# Altium schematic sheet Power delivery.SchDoc
size A3; SheetNumber: 4; SheetTotal: 7
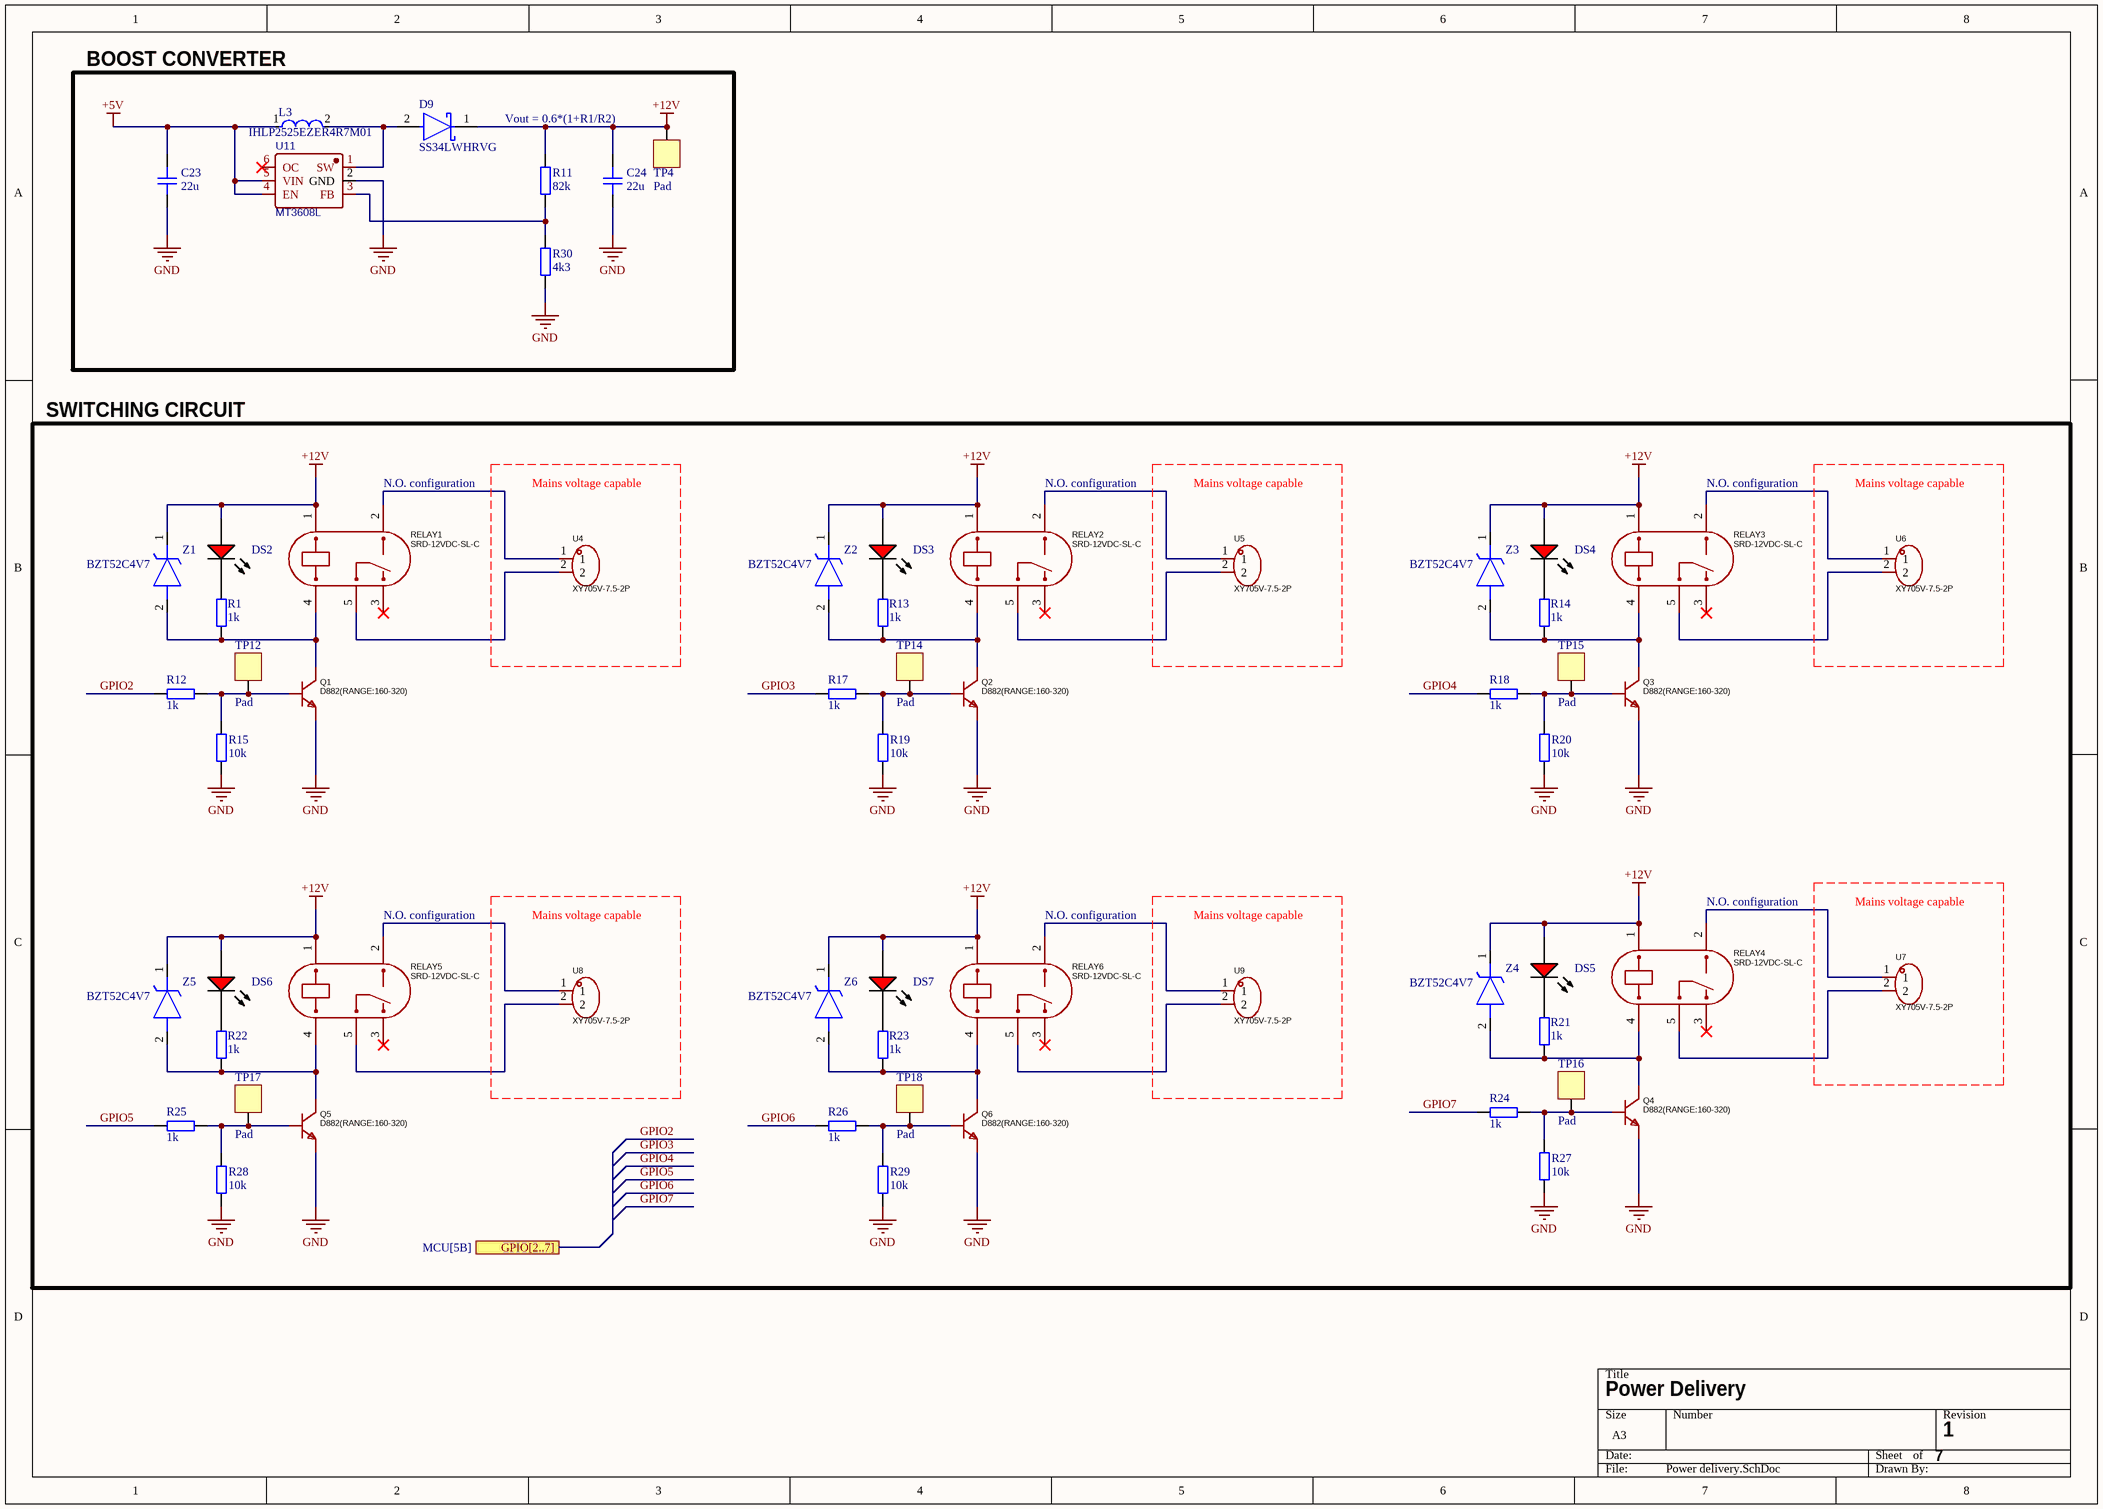
[diagram p0: Power delivery.SchDoc]

## Parts
C23  Rating: 22u  [CAP_0402]  (hidden comment: GRM158R61A226ME15D)
C24  Rating: 22u  [CAP_0402]  (hidden comment: GRM158R61A226ME15D)
D9  SS34LWHRVG  [FP-SS34LWH-MFG]
DS2  LTST-C170KRKT  [LTST-C170KRKT_V]  (value not drawn)
DS3  LTST-C170KRKT  [LTST-C170KRKT_V]  (value not drawn)
DS4  LTST-C170KRKT  [LTST-C170KRKT_V]  (value not drawn)
DS5  LTST-C170KRKT  [LTST-C170KRKT_V]  (value not drawn)
DS6  LTST-C170KRKT  [LTST-C170KRKT_V]  (value not drawn)
DS7  LTST-C170KRKT  [LTST-C170KRKT_V]  (value not drawn)
L3  IHLP2525EZER4R7M01  [FP-IHLP-2525EZ-FP_2_413x3-MFG]
Q1  D882(RANGE:160-320)  [SOT-89-3_L4.5-W2.5-P1.50-LS4.2-BR]
Q2  D882(RANGE:160-320)  [SOT-89-3_L4.5-W2.5-P1.50-LS4.2-BR]
Q3  D882(RANGE:160-320)  [SOT-89-3_L4.5-W2.5-P1.50-LS4.2-BR]
Q4  D882(RANGE:160-320)  [SOT-89-3_L4.5-W2.5-P1.50-LS4.2-BR]
Q5  D882(RANGE:160-320)  [SOT-89-3_L4.5-W2.5-P1.50-LS4.2-BR]
Q6  D882(RANGE:160-320)  [SOT-89-3_L4.5-W2.5-P1.50-LS4.2-BR]
R1  value 1k  [RES_1206]  (hidden comment: RC1206FR-7W1KL)
R11  value 82k  [RES_0402]  (hidden comment: 0402WGF8202TCE)
R12  value 1k  [RES_1206]  (hidden comment: RC1206FR-7W1KL)
R13  value 1k  [RES_1206]  (hidden comment: RC1206FR-7W1KL)
R14  value 1k  [RES_1206]  (hidden comment: RC1206FR-7W1KL)
R15  value 10k  [RES_1206]  (hidden comment: 1206W4F1002T5E)
R17  value 1k  [RES_1206]  (hidden comment: RC1206FR-7W1KL)
R18  value 1k  [RES_1206]  (hidden comment: RC1206FR-7W1KL)
R19  value 10k  [RES_1206]  (hidden comment: 1206W4F1002T5E)
R20  value 10k  [RES_1206]  (hidden comment: 1206W4F1002T5E)
R21  value 1k  [RES_1206]  (hidden comment: RC1206FR-7W1KL)
R22  value 1k  [RES_1206]  (hidden comment: RC1206FR-7W1KL)
R23  value 1k  [RES_1206]  (hidden comment: RC1206FR-7W1KL)
R24  value 1k  [RES_1206]  (hidden comment: RC1206FR-7W1KL)
R25  value 1k  [RES_1206]  (hidden comment: RC1206FR-7W1KL)
R26  value 1k  [RES_1206]  (hidden comment: RC1206FR-7W1KL)
R27  value 10k  [RES_1206]  (hidden comment: 1206W4F1002T5E)
R28  value 10k  [RES_1206]  (hidden comment: 1206W4F1002T5E)
R29  value 10k  [RES_1206]  (hidden comment: 1206W4F1002T5E)
R30  value 4k3  [RES_0402]  (hidden comment: RC0402FR-074K3L)
RELAY1  SRD-12VDC-SL-C  [RELAY-TH_SRD-XXVDC-XL-C]
RELAY2  SRD-12VDC-SL-C  [RELAY-TH_SRD-XXVDC-XL-C]
RELAY3  SRD-12VDC-SL-C  [RELAY-TH_SRD-XXVDC-XL-C]
RELAY4  SRD-12VDC-SL-C  [RELAY-TH_SRD-XXVDC-XL-C]
RELAY5  SRD-12VDC-SL-C  [RELAY-TH_SRD-XXVDC-XL-C]
RELAY6  SRD-12VDC-SL-C  [RELAY-TH_SRD-XXVDC-XL-C]
TP4  Pad  [PAD_SQ_2MM]  (no BOM)
TP12  Pad  [PAD_SQ_2MM]  (no BOM)
TP14  Pad  [PAD_SQ_2MM]  (no BOM)
TP15  Pad  [PAD_SQ_2MM]  (no BOM)
TP16  Pad  [PAD_SQ_2MM]  (no BOM)
TP17  Pad  [PAD_SQ_2MM]  (no BOM)
TP18  Pad  [PAD_SQ_2MM]  (no BOM)
U4  XY705V-7.5-2P  [CONN-TH_XY705V-7.5-2P]
U5  XY705V-7.5-2P  [CONN-TH_XY705V-7.5-2P]
U6  XY705V-7.5-2P  [CONN-TH_XY705V-7.5-2P]
U7  XY705V-7.5-2P  [CONN-TH_XY705V-7.5-2P]
U8  XY705V-7.5-2P  [CONN-TH_XY705V-7.5-2P]
U9  XY705V-7.5-2P  [CONN-TH_XY705V-7.5-2P]
U11  MT3608L  [SOT-23-6_L2.9-W1.6-P0.95-LS2.8-BL_3]
Z1  BZT52C4V7  [BZT52C4V7]
Z2  BZT52C4V7  [BZT52C4V7]
Z3  BZT52C4V7  [BZT52C4V7]
Z4  BZT52C4V7  [BZT52C4V7]
Z5  BZT52C4V7  [BZT52C4V7]
Z6  BZT52C4V7  [BZT52C4V7]

## Blocks framed on the sheet
BOOST CONVERTER: C23 C24 D9 L3 R11 R30 TP4 U11
SWITCHING CIRCUIT: DS2-DS7 Q1-Q6 R1 R12-R15 R17-R29 RELAY1-RELAY6 TP12 TP14-TP18 U4-U9 Z1-Z6

## Ports
GPIO[2..7] (see MCU[5B])

## Nets
+5V: C23.2 L3.1 U11.4(EN) U11.5(VIN)
+12V: C24.2 D9.1(C) DS2.1(A) DS3.1(A) DS4.1(A) DS5.1(A) DS6.1(A) DS7.1(A) R11.2 RELAY1.1 RELAY2.1 RELAY3.1 RELAY4.1 RELAY5.1 RELAY6.1 TP4.1 Z1.1(K) Z2.1(K) Z3.1(K) Z4.1(K) Z5.1(K) Z6.1(K)
GND: C23.1 C24.1 Q1.3(E) Q2.3(E) Q3.3(E) Q4.3(E) Q5.3(E) Q6.3(E) R15.1 R19.1 R20.1 R27.1 R28.1 R29.1 R30.1 U11.2(GND)
GPIO2: R12.2
GPIO3: R17.2
GPIO4: R18.2
GPIO5: R25.2
GPIO6: R26.2
GPIO7: R24.2
NetD9_2: D9.2(A) L3.2 U11.1(SW)
NetDS2_2: DS2.2(K) R1.1
NetDS3_2: DS3.2(K) R13.1
NetDS4_2: DS4.2(K) R14.1
NetDS5_2: DS5.2(K) R21.1
NetDS6_2: DS6.2(K) R22.1
NetDS7_2: DS7.2(K) R23.1
NetQ1_1: Q1.1(B) R12.1 R15.2 TP12.1
NetQ1_2: Q1.2(C) R1.2 RELAY1.4 Z1.2(A)
NetQ2_1: Q2.1(B) R17.1 R19.2 TP14.1
NetQ2_2: Q2.2(C) R13.2 RELAY2.4 Z2.2(A)
NetQ3_1: Q3.1(B) R18.1 R20.2 TP15.1
NetQ3_2: Q3.2(C) R14.2 RELAY3.4 Z3.2(A)
NetQ4_1: Q4.1(B) R24.1 R27.2 TP16.1
NetQ4_2: Q4.2(C) R21.2 RELAY4.4 Z4.2(A)
NetQ5_1: Q5.1(B) R25.1 R28.2 TP17.1
NetQ5_2: Q5.2(C) R22.2 RELAY5.4 Z5.2(A)
NetQ6_1: Q6.1(B) R26.1 R29.2 TP18.1
NetQ6_2: Q6.2(C) R23.2 RELAY6.4 Z6.2(A)
NetR11_1: R11.1 R30.2 U11.3(FB)
NetRELAY1_2: RELAY1.2 U4.1
NetRELAY1_5: RELAY1.5 U4.2
NetRELAY2_2: RELAY2.2 U5.1
NetRELAY2_5: RELAY2.5 U5.2
NetRELAY3_2: RELAY3.2 U6.1
NetRELAY3_5: RELAY3.5 U6.2
NetRELAY4_2: RELAY4.2 U7.1
NetRELAY4_5: RELAY4.5 U7.2
NetRELAY5_2: RELAY5.2 U8.1
NetRELAY5_5: RELAY5.5 U8.2
NetRELAY6_2: RELAY6.2 U9.1
NetRELAY6_5: RELAY6.5 U9.2

Not connected (* = marked no-connect by the designer): RELAY1 3*; RELAY2 3*; RELAY3 3*; RELAY4 3*; RELAY5 3*; RELAY6 3*; U11 6(OC)*

## Notes on the sheet
- Vout = 0.6*(1+R1/R2)
- (near RELAY1) N.O. configuration
- Mains voltage capable
- (near RELAY2) N.O. configuration
- (near RELAY3) N.O. configuration
- (near RELAY5) N.O. configuration
- (near RELAY6) N.O. configuration
- (near RELAY4) N.O. configuration
- Power Delivery
- 7
- 1

## Library data of the parts
C23 C24 = CAP_0402: Capacitor SMD 0402; Manufacturer: *; Manufacturer Part Number: *; Distributor Link: *; LCSC: *; Dielectric: *
D9 = CMP-15604-000001-1: DIODE SCHOTTKY 40V 3A SOD123W; RoHS Compliant: Yes
DS2-DS7 = CMP-2000-07593-1: LED Red, 75 mW, 54 mcd, -55 to 85 degC, 2-Pin SMD, RoHS, Tape and Reel; Manufacturer: Lite-On; Lens Transparency: Clear; Number of Elements: 1; Power Rating: 75mW; Luminous Intensity: 54mcd; Viewing Angle: 130degrees; Forward Current: 30mA; Wavelength: 639nm; Lens Style: Rectangular; Case\/Package: 0805; Test Current: 20mA; Dominant Wavelength: 631nm; Forward Voltage: 2V; Lens Colour: Colorless; Min Operating Temperature: -55degC; RoHSCompliant: True; Length: 3.2mm; Width: 1.25mm; Mount: SurfaceMount; Packaging: TapeandReel; Number of LEDs: 1; Radiation Hardening: No; Datasheet URL: http://optoelectronics.liteon.com/upload/download/DS-22-99-0150/LTST-C170KRKT.pdf; Datasheet Version: Rev. D, 11/2014; Case Code (Metric): 2012; Height: 1.1mm; Number of Pins: 2; Package Description: 2-Pin Surface Mount Device, Body 2 x 1.25 mm; Manufacturer URL: http://www.us.liteon.com/; Lead Free: LeadFree; Illumination Colour: Red; Colour: Red; Case Code (Imperial): 0805; Max Operating Temperature: 85degC; Power Dissipation: 75mW; Mounting Technology: SurfaceMount; Package Reference: C170KRKT; Package Quantity: 1; Depth: 1.6mm
L3 = CMP-02424-000065-1: Commercial Inductors, High Saturation Series 4.7uH 6.5A 30.3mΩ 20%; DC Resistance (DCR): 30.3mR; Saturation Current: 7A; Shielding: Shielded; Core Material: Ferrite; Self Resonant Frequency: 1MHz; Test Frequency: 100kHz; Number of Pins: 2; Case/Package: 2525; Lead Free: Lead Free; Depth: 6.72mm; Height - Seated (Max): 0.197inch; Mount: Surface Mount; Termination: SMD/SMT; Max Operating Temperature: 125°C; Inductance Tolerance: 20%; Military Standard: Not; Height: 5mm; RMS Current (Irms): 6.5A; Current Rating: 6.5A; Radiation Hardening: No; Package Quantity: 500; Packaging: Tape and Reel; Width: 0.255inch; Max DC Current: 6.5A; Length: 6.86mm; Min Operating Temperature: -55°C; Tolerance: 20%; Inductance: 4.7uH
Q1-Q6 = D882(RANGE:160-320)_C9634: Manufacturer: CJ(江苏长电/长晶); Symbol: D882_C9634; Add into BOM: yes; type: NPN; Current - Collector(Ic): 3A; Collector - Emitter Voltage VCEO: 30V; Pd - Power Dissipation: 500mW; DC Current Gain: 160@1A,2V; Transition frequency(fT): 50MHz; Current - Collector Cutoff: 1uA; Vce Saturation(VCE(sat)): 500mV; Device: D882(RANGE:160-320)_C9634; LCSC Part Name: Y档 160~320; Supplier Part: C9634; Manufacturer Part: D882(RANGE:160-320); Supplier Footprint: SOT-89-3; JLCPCB Part Class: Basic Part; Datasheet: https://atta.szlcsc.com/upload/public/pdf/source/20121027/1457706543612.pdf; Supplier: LCSC; Convert to PCB: yes; Operating Temperature: -55℃~+150℃
R1 R12-R14 R17 R18 R21-R26 = RES_1206: Resistor SMD 1206 1k 0.5W; Manufacturer: *; Manufacturer Part Number: *; Distributor Link: *; LCSC: *
R11 R30 = RES_0402: Resistor SMD 0402; Manufacturer: *; Manufacturer Part Number: *; Distributor Link: *; LCSC: *
R15 R19 R20 R27-R29 = RES_1206: Resistor SMD 1206 10k 0.25W; Manufacturer: *; Manufacturer Part Number: *; Distributor Link: *; LCSC: *
RELAY1-RELAY6 = SRD-12VDC-SL-C: Manufacturer: 松乐; Add into BOM: yes; Coil Voltage: 12V; Contact Form: One Conversion: 1C (SPDT-Conversion); Pin Number: 5; Maximum Switching Voltage: 250V@AC; Coil Rated Power: 360mW; Maximum Switching Current: 15A; Coil Type: Non-polar - Single Coil; Coil Resistance: 400Ω; Contact Resistance: 100mΩ; Operate Time: 10ms; Symbol: SRD-12VDC-SL-C; Device: SRD-12VDC-SL-C; LCSC Part Name: SRD-12VDC-SL-C; Supplier Part: C30431; Manufacturer Part: SRD-12VDC-SL-C; Supplier Footprint: 插件,15.6x19.2mm; JLCPCB Part Class: Extended Part; Datasheet: https://atta.szlcsc.com/upload/public/pdf/source/20200305/C490149_C96E4098A3B1FFB377D5AD2E40B7C2A8.pdf; Supplier: LCSC; Convert to PCB: yes; Contact Rating: -; Release Time: 10ms
TP4 TP12 TP14-TP18 = PAD_SQ_2MM: Test Point Square 2mm
U4-U9 = XY705V-7.5-2P: Manufacturer: XINLAIYA(新莱亚); Add into BOM: yes; Number of Positions or Pins: 1x2P; Pitch: 7.5mm; Number of PINs Per Row: 2; Screw Specification: M2.5; Current Rating: 15A; Voltage Rating (Max): 300V; Wire Gauge - AWG: 14~22; Wire Gauge - mm2: 2.5; Symbol: XY705V-7.5-2P; Device: XY705V-7.5-2P; LCSC Part Name: 1x2P 7.5mm 直插 排数:1 每排P数:2; Supplier Part: C557657; Manufacturer Part: XY705V-7.5-2P; Supplier Footprint: 插件,P=7.5mm; JLCPCB Part Class: Extended Part; Datasheet: https://atta.szlcsc.com/upload/public/pdf/source/20200527/C557658_B3C8AA697A6B8DAEB465BA1D7AD16B40.pdf; Supplier: LCSC; Convert to PCB: yes; Color: Black; Mounting Type: Straight; Number of Pins: 2P; Number of Rows: 1; Operating Temperature: -
U11 = MT3608L: Manufacturer: 西安航天民芯; Contributor: LCSC; Supplier: LCSC; Supplier Part: C2932326; Manufacturer Part: MT3608L; JLCPCB Part Class: Extended Part; spicePre: U; spiceSymbolName: MT3608L
Z1-Z6 = BZT52C4V7: Zener Diode; Manufacturer_Name: Diotec; Datasheet Link: https://www.diodes.com/assets/Datasheets/ds18004.pdf; Height: 1.35mm; Manufacturer_Part_Number: BZT52C4V7; Mouser Part Number: 637-BZT52C4V7; Mouser Price/Stock: https://www.mouser.co.uk/ProductDetail/Diotec-Semiconductor/BZT52C4V7?qs=OlC7AqGiEDnKHszikXcSEg%3D%3D; Arrow Part Number: BZT52C4V7; Arrow Price/Stock: https://www.arrow.com/en/products/bzt52c4v7/diotec-semiconductor-ag?utm_currency=USD&region=europe